# EAGLE design reward_port (EAGLE 6.6.0)
DESIGNER: jakob voigts; DESIGN_NAME: reward port; REVISION: 0.1
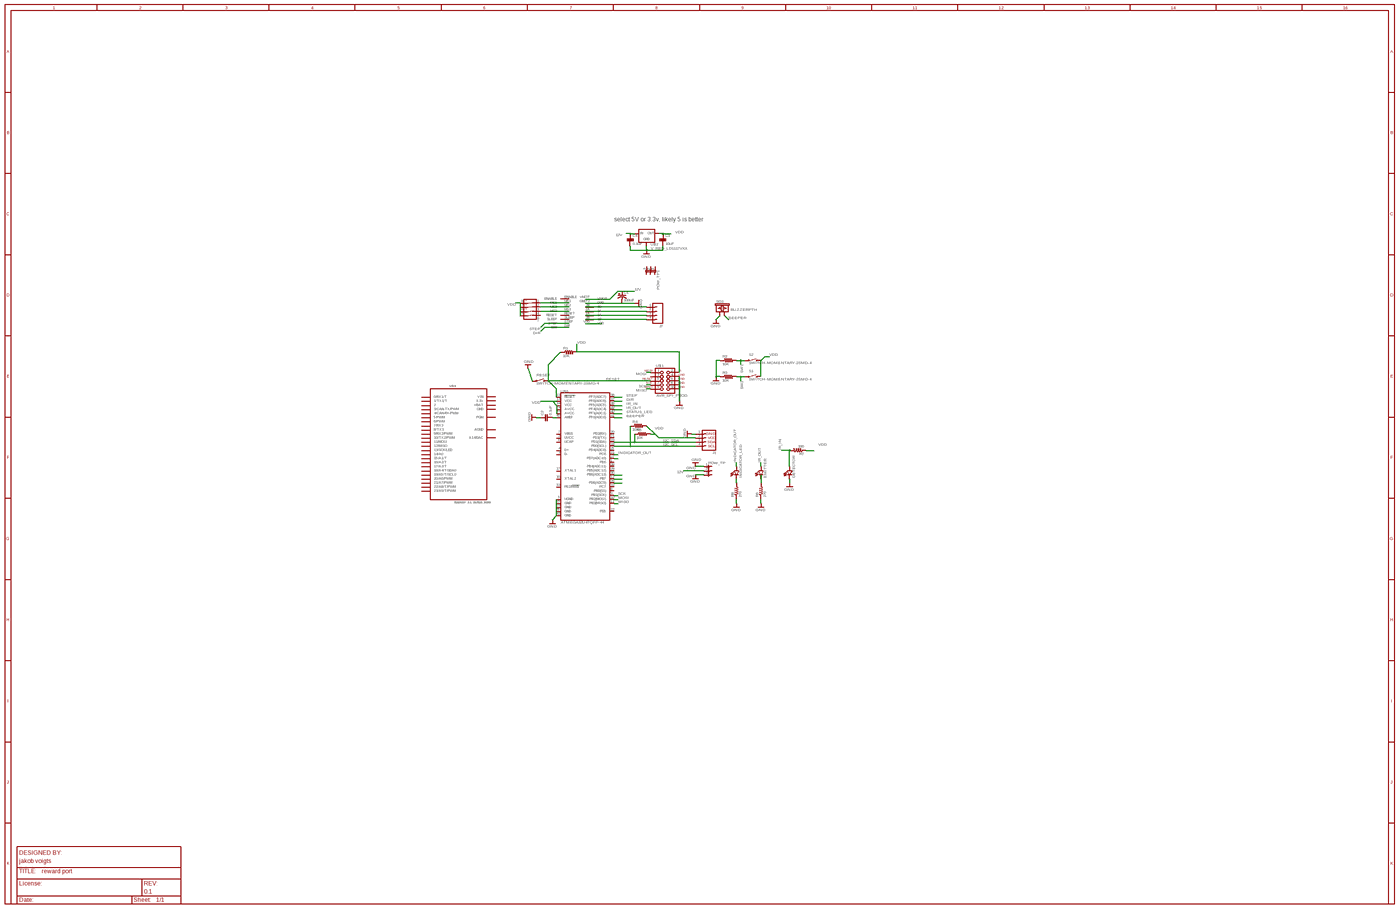
[diagram p0: schematic, sheet 1, overview]
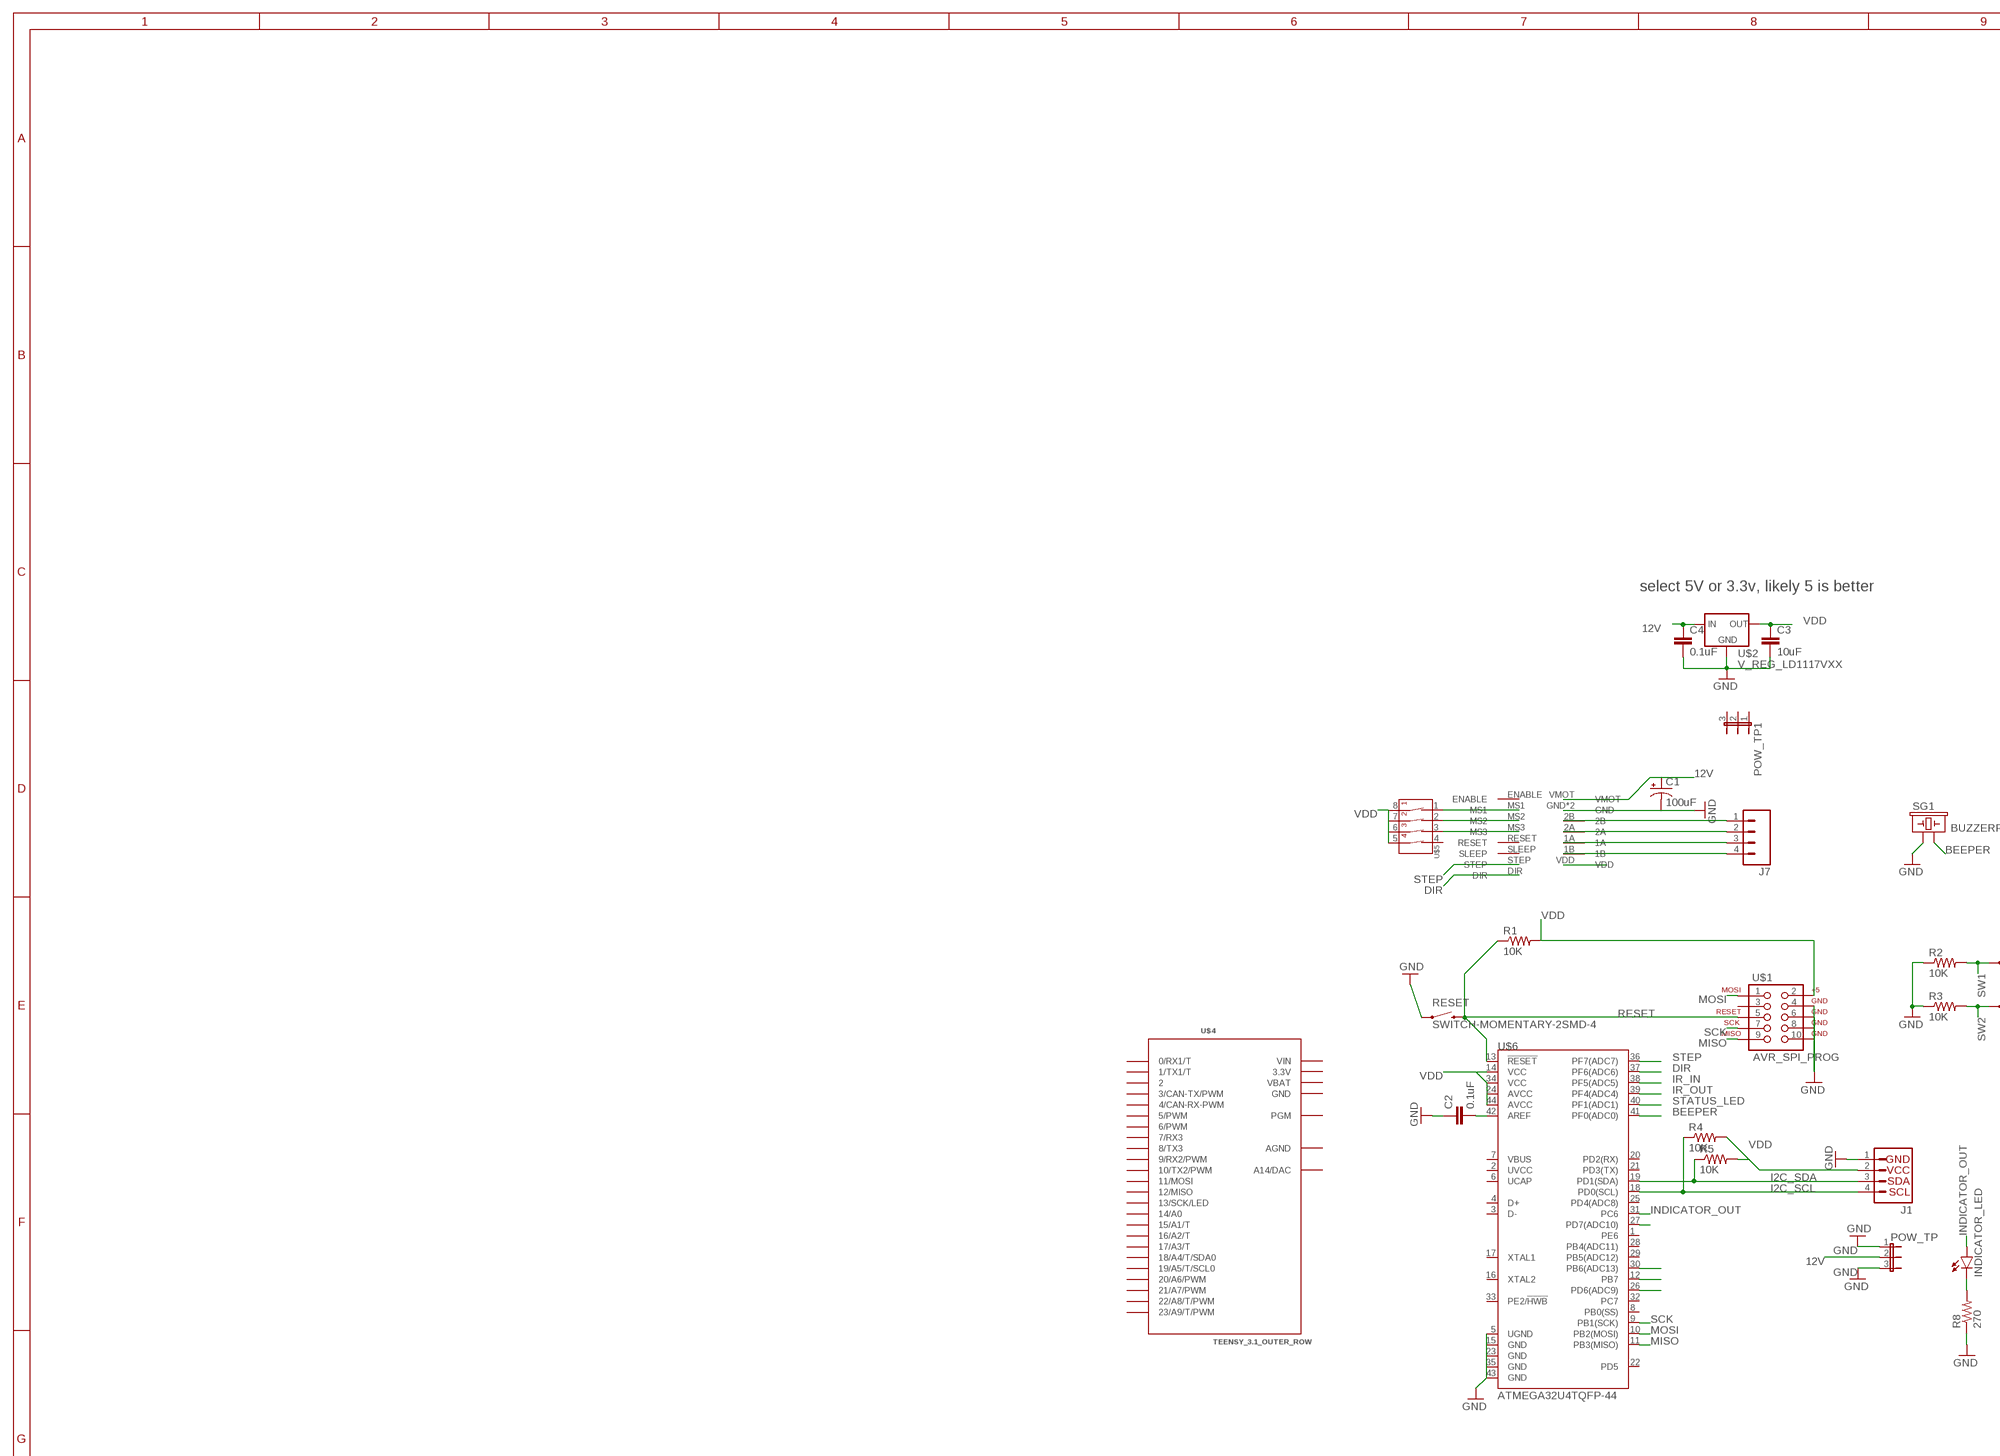
[diagram p1: schematic, sheet 1, part 1 of 4]
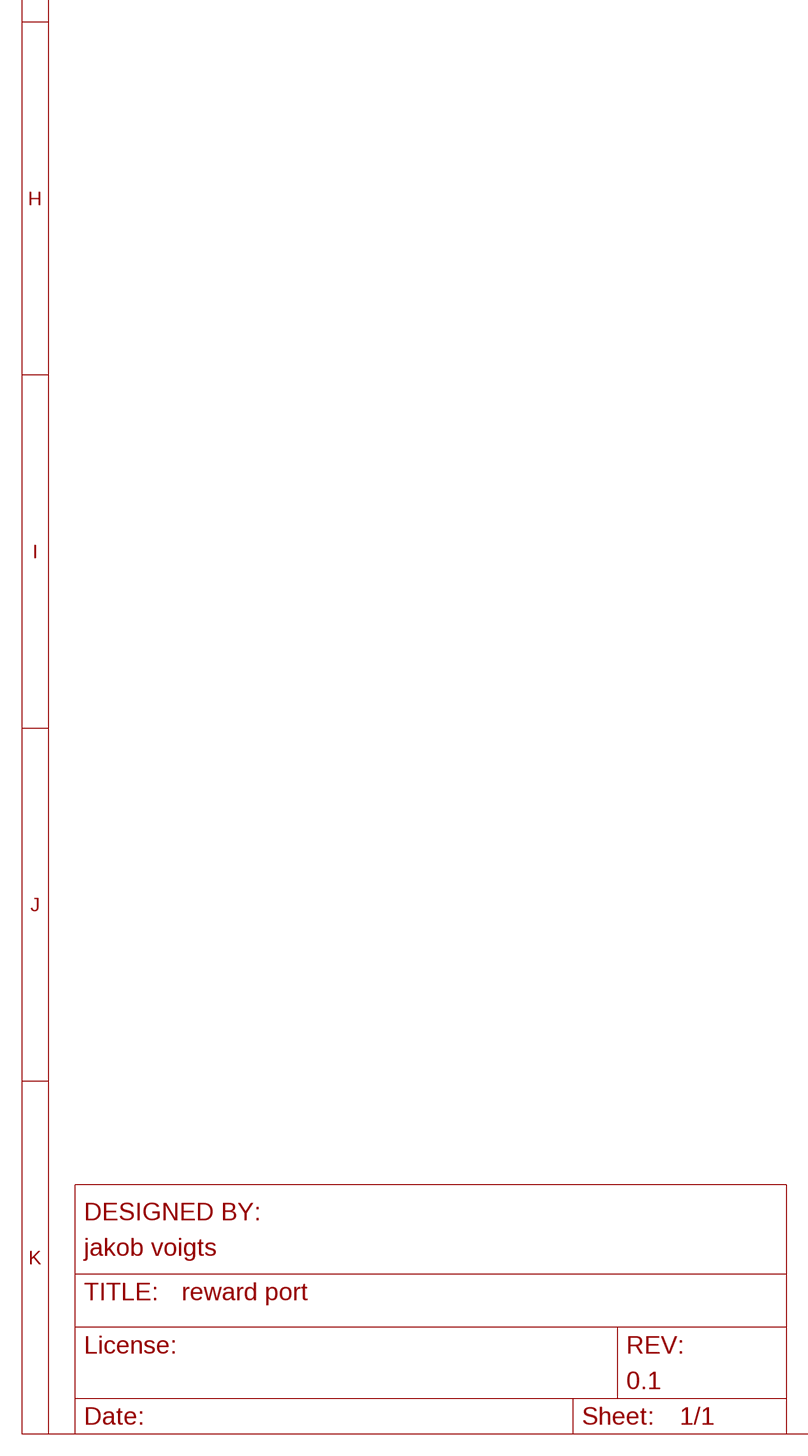
[diagram p2: schematic, sheet 1, part 2 of 4]
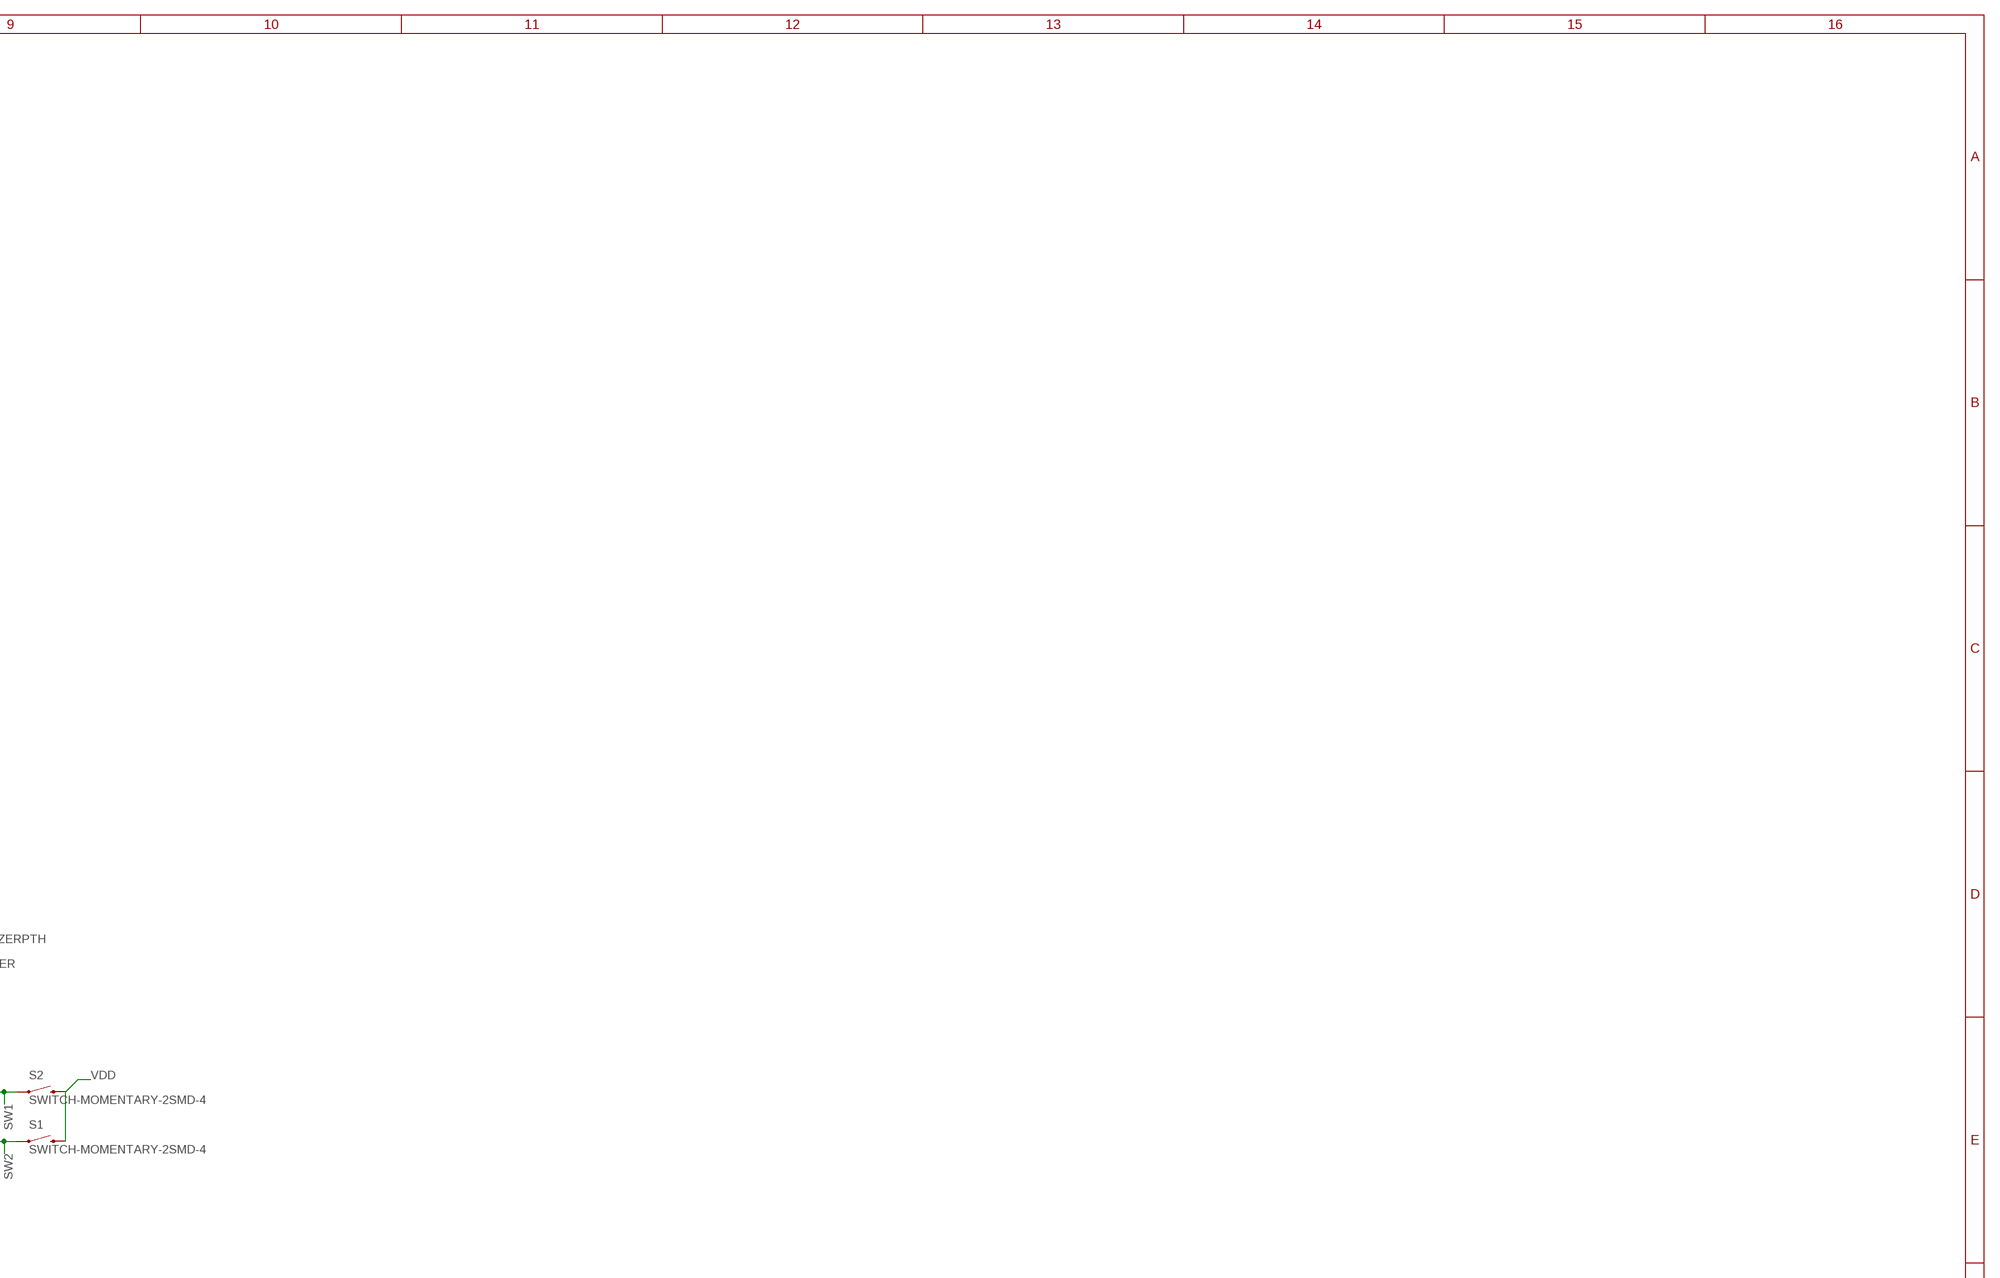
[diagram p3: schematic, sheet 1, part 3 of 4]
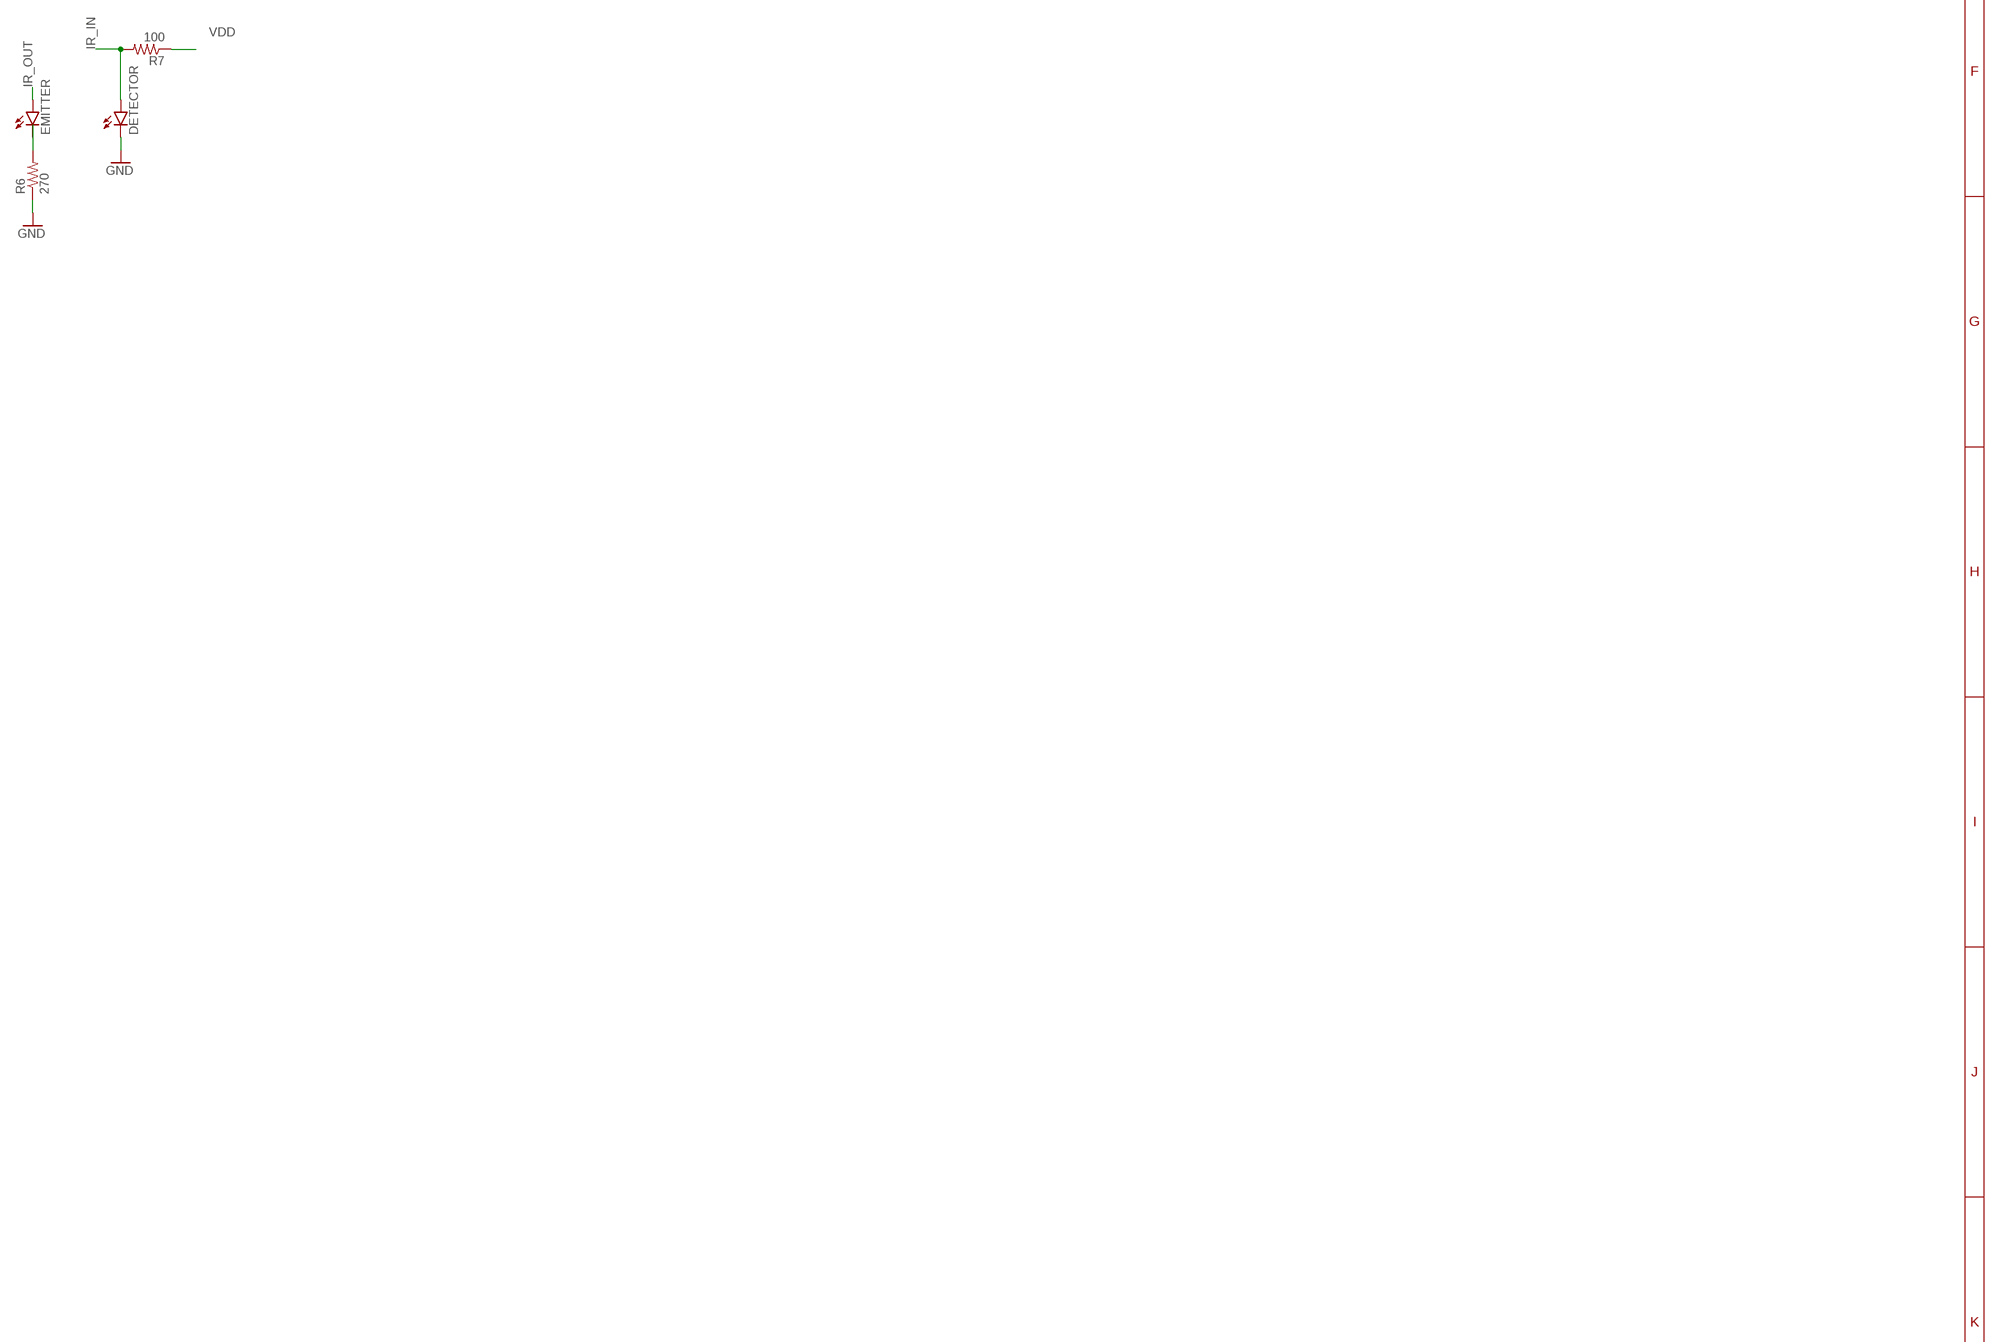
[diagram p4: schematic, sheet 1, part 4 of 4]

## Parts
C1  100uF  100UF-10V-10%(TANT)  [EIA7343]
C2  0.1uF  0.1UF-25V(+80/-20%)(0603)  [0603-CAP]
C3  10uF  10UF-6.3V-20%(0603)  [0603-CAP]
C4  0.1uF  0.1UF-25V-5%(0603)  [0603-CAP]
DETECTOR  LED-3MM-NO_SILK  [LED3MM-NS]
EMITTER  LED-3MM-NO_SILK  [LED3MM-NS]
INDICATOR_LED  LED-3MM-NO_SILK  [LED3MM-NS]
J1  I2C_STANDARD  [1X04]
J7  M04POLAR  [MOLEX-1X4]
POW_TP  JP3E  [JP3]
POW_TP1  JP3E  [JP3]
R1  10K  10KOHM-1/10W-1%(0603)0603  [0603-RES]
R2  10K  10KOHM-1/10W-1%(0603)0603  [0603-RES]
R3  10K  10KOHM-1/10W-1%(0603)0603  [0603-RES]
R4  10K  10KOHM-1/10W-1%(0603)0603  [0603-RES]
R5  10K  10KOHM-1/10W-1%(0603)0603  [0603-RES]
R6  270  10KOHM-1/10W-1%(0603)0603  [0603-RES]
R7  100  10KOHM-1/10W-1%(0603)0603  [0603-RES]
R8  270  10KOHM-1/10W-1%(0603)0603  [0603-RES]
RESET  SWITCH-MOMENTARY-2SMD-4  [TACTILE_SWITCH_TALL]
S1  SWITCH-MOMENTARY-2SMD-4  [TACTILE_SWITCH_TALL]
S2  SWITCH-MOMENTARY-2SMD-4  [TACTILE_SWITCH_TALL]
SG1  BUZZERPTH  [BUZZER-12MM]
U$1  AVR_SPI_PROG  [AVR_ICSP]
U$2  V_REG_LD1117VXX  [78XXL]
U$3  A4988  [A4988]
U$4  TEENSY_3.1_OUTER_ROW  [TEENSY3-OUTER_ROW]
U$5  4-POS-DIP  [4-POS-DIP-SMD]
U$6  ATMEGA32U4TQFP-44  [TQFP44]

## Nets
12V: C1.A(+) C4.1 POW_TP.2 U$2.OUT(IN) U$3.VMOT
BEEPER: SG1.- U$6.41(PF0(ADC0))
DIR: U$3.DIR U$6.37(PF6(ADC6))
GND: C1.C(-) C2.1 C3.2 C4.2 DETECTOR.K(C) J1.1 POW_TP.1 POW_TP.3 R2.1 R3.1 R6.1 R8.1 RESET.A2 SG1.+ U$1.4 U$1.6 U$1.8 U$1.10 U$2.IN(GND) U$3.GND U$3.GND2(GND) U$6.5(UGND) U$6.15(GND) U$6.23(GND) U$6.35(GND) U$6.43(GND)
I2C_SCL: J1.4 R4.1 U$6.18(PD0(SCL))
I2C_SDA: J1.3 R5.1 U$6.19(PD1(SDA))
INDICATOR_OUT: INDICATOR_LED.A U$6.31(PC6)
IR_IN: DETECTOR.A R7.2 U$6.38(PF5(ADC5))
IR_OUT: EMITTER.A U$6.39(PF4(ADC4))
MISO: U$1.9 U$6.11(PB3(MISO))
MOSI: U$1.1 U$6.10(PB2(MOSI))
N$4: U$6.27(PD7(ADC10))
N$5: U$6.30(PB6(ADC13))
N$6: J7.1 U$3.2B
N$7: J7.2 U$3.2A
N$8: J7.3 U$3.1A
N$9: J7.4 U$3.1B
N$10: U$6.12(PB7)
N$11: U$3.MS1 U$5.1(1A)
N$12: U$3.MS2 U$5.2(2A)
N$13: U$3.MS3 U$5.3(3A)
N$14: U$6.26(PD6(ADC9))
N$15: C2.2 U$6.42(AREF)
N$16: INDICATOR_LED.K(C) R8.2
N$21: EMITTER.K(C) R6.2
RESET: R1.1 RESET.B2 U$1.5 U$6.13(!RESET)
SCK: U$1.7 U$6.9(PB1(SCK))
STATUS_LED: U$6.40(PF1(ADC1))
STEP: U$3.STEP U$6.36(PF7(ADC7))
SW1: R2.2 S2.A2
SW2: R3.2 S1.A2
VDD: C3.1 J1.2 R1.2 R4.2 R5.2 R7.1 S1.B2 S2.B2 U$1.2 U$2.GND(OUT) U$3.VDD U$5.5(4B) U$5.6(3B) U$5.7(2B) U$5.8(1B) U$6.14(VCC) U$6.24(AVCC) U$6.34(VCC) U$6.44(AVCC)
Unconnected: POW_TP1.1 POW_TP1.2 POW_TP1.3 U$1.3 U$3.ENABLE U$3.RESET U$3.SLEEP U$4.0(0/RX1/T) U$4.1(1/TX1/T) U$4.2 U$4.3(3/CAN-TX/PWM) U$4.4(4/CAN-RX-PWM) U$4.5(5/PWM) U$4.6(6/PWM) U$4.7(7/RX3) U$4.8(8/TX3) U$4.9(9/RX2/PWM) U$4.10(10/TX2/PWM) U$4.11(11/MOSI) U$4.12(12/MISO) U$4.13(13/SCK/LED) U$4.14/A0 U$4.15/A1(15/A1/T) U$4.16/A2(16/A2/T) U$4.17/A3(17/A3/T) U$4.18/A4(18/A4/T/SDA0) U$4.19/A5(19/A5/T/SCL0) U$4.20/A6(20/A6/PWM) U$4.21/A7(21/A7/PWM) U$4.22/A8(22/A8/T/PWM) U$4.23/A9(23/A9/T/PWM) U$4.PGM U$4.RESET/DAC(A14/DAC) U$5.4(4A) U$6.1(PE6) U$6.2(UVCC) U$6.3(D-) U$6.4(D+) U$6.6(UCAP) U$6.7(VBUS) U$6.8(PB0(SS)) U$6.16(XTAL2) U$6.17(XTAL1) U$6.20(PD2(RX)) U$6.21(PD3(TX)) U$6.22(PD5) U$6.25(PD4(ADC8)) U$6.28(PB4(ADC11)) U$6.29(PB5(ADC12)) U$6.32(PC7) U$6.33(PE2/!HWB)

## Notes on the sheet
- select 5V or 3.3v, likely 5 is better

## Power pins joined to a net without a drawn wire
3.3V: U$4.3.3V U$4.3.3V1(3.3V)
AGND: U$4.AGND
GND: U$4.GND U$4.GND1(GND)
VBAT: U$4.VBAT
VIN: U$4.VIN

## Library data of the parts
C1 = SparkFun-Capacitors:100UF-10V-10%(TANT): CAP-07890; PROD_ID: CAP-07890
C2 = SparkFun-Capacitors:0.1UF-25V(+80/-20%)(0603): CAP-00810 Ceramic Standard decoupling cap; PROD_ID: CAP-00810
C3 = SparkFun-Capacitors:10UF-6.3V-20%(0603): CAP-11015; PROD_ID: CAP-11015
C4 = SparkFun-Capacitors:0.1UF-25V-5%(0603): CAP-08604; PROD_ID: CAP-08604
DETECTOR EMITTER INDICATOR_LED = SparkFun-LED:LED: LEDs Standard schematic elements and footprints for 5mm, 3mm, 1206, and 0603 sized LEDs. 5mm - Spark Fun Electronics SKU : COM-00529 (and others)
J1 = SparkFun-Connectors:I2C_STANDARD: SparkFun has standardized on a pinout for all I2C based sensor breakouts. This pinout allows I2C boards to be plugged directly into the headers on Arduino Uno compatible boards, and to be daisy chained easily.
J7 = SparkFun-Connectors:M04: Header 4 Standard 4-pin 0.1" header. Use with straight break away headers (SKU : PRT-00116), right angle break away headers (PRT-00553), swiss pins (PRT-00743), machine pins (PRT-00117), and female headers (PRT-00115). Molex polarized connector foot print use with SKU : PRT-08231 with associated crimp pins and housings. 1MM SMD Version SKU: PRT-10208
POW_TP POW_TP1 = jonnew:JP3E
R1-R5 = SparkFun-Resistors:10KOHM-1/10W-1%(0603): RES-00824; PROD_ID: RES-00824
R6-R8 = SparkFun-Resistors:10KOHM-1/10W-1%(0603): RES-00824; PROD_ID: RES-00824; VALUE: 10K
RESET S1 S2 = SparkFun-Electromechanical:SWITCH-MOMENTARY-2: Various NO switches- pushbuttons, reed, etc; PROD_ID: SWCH-11966
SG1 = SparkFun-Electromechanical:BUZZER: Buzzer 12mm Spark Fun Electronics SKU : Comp-Buzzer
U$1 = SparkFun-Connectors:AVR_SPI_PROG: AVR 10-pin ICSP Header This is the standard AVR In Circuit Serial Programming header. Minimal, but includes pin one indicator. Works with standard Olimex programmers. Also look for the 6-pin reduced version. Spark Fun Electronics SKU: PRT-00778
U$2 = SparkFun-PowerIC:V_REG_LD1117VXX: LD1117VXX voltage regulator. We carry the 3.3V version (COM-00526) in TO-220 package.
U$3 = behaviour_pcb_parts:A4988
U$4 = Teensy_3_and_LC_Series_Boards_v1.1:TEENSY_3.1_OUTER_ROW: Footprint for Teensy 3.1 or 3.2 board using all pin connections on the outer perimeter
U$5 = SparkFun-Electromechanical:4-POS-DIP: 4 Position DIP Switch CTS series 219; PROD_ID: SWCH-12418
U$6 = SparkFun-DigitalIC:ATMEGA32U4: Atmel 44-pin 8-bit Microcontroller with 32KBytes of ISP Flash and USB Controller

## Board
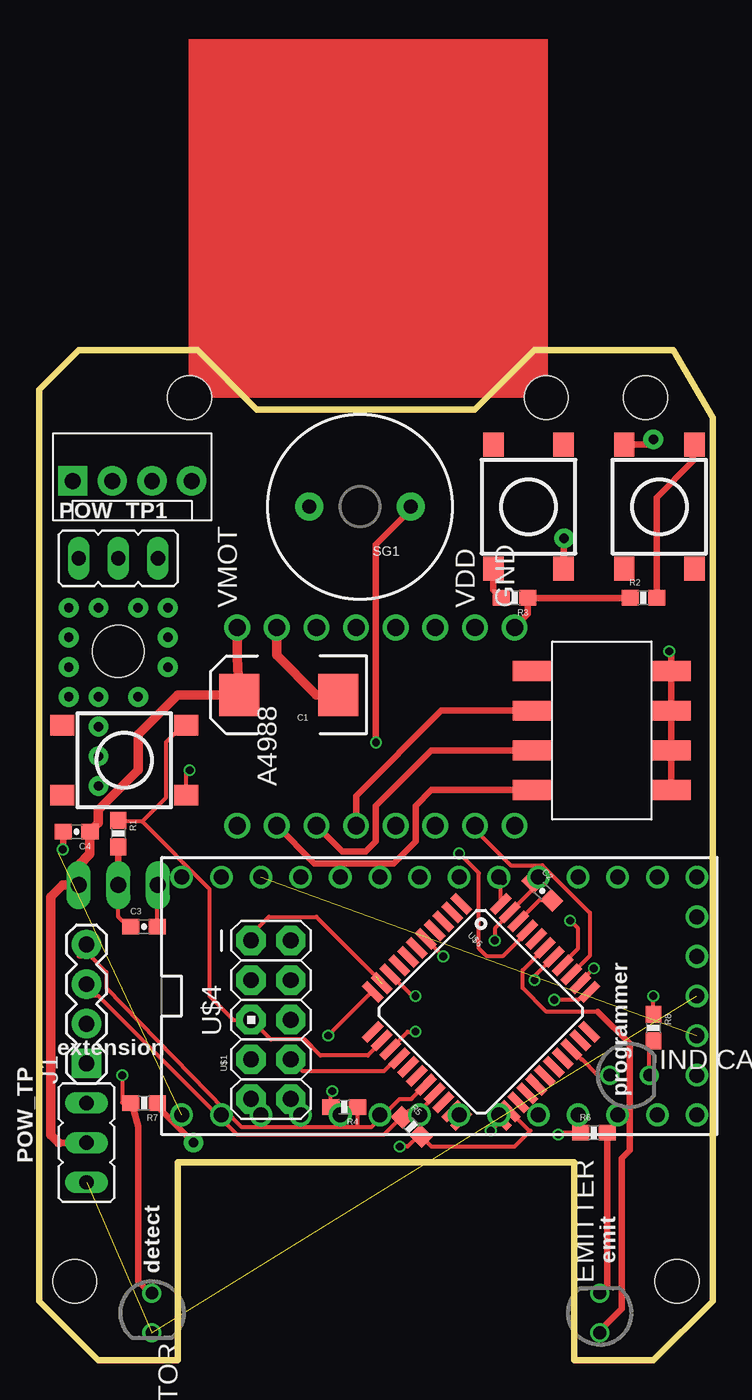
[diagram p5: board, top side]
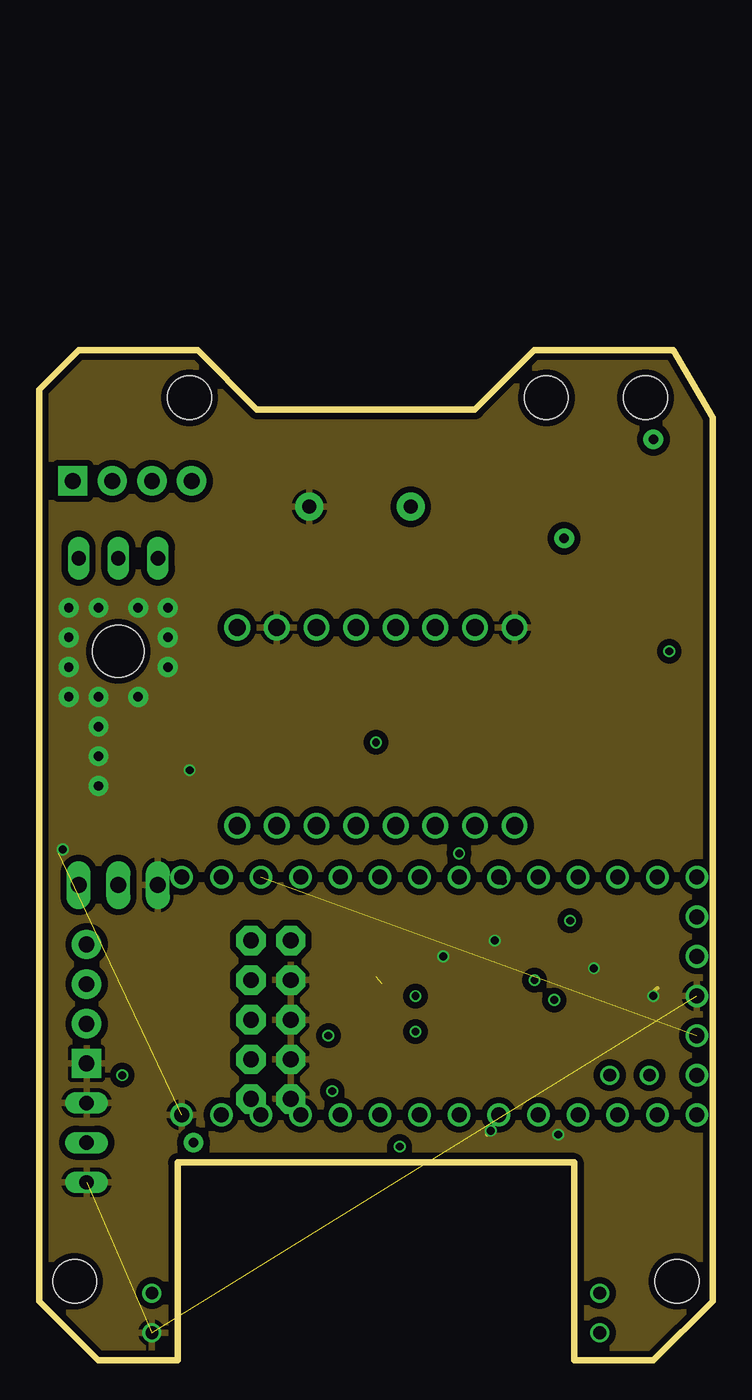
[diagram p6: board, inner layer $GND]
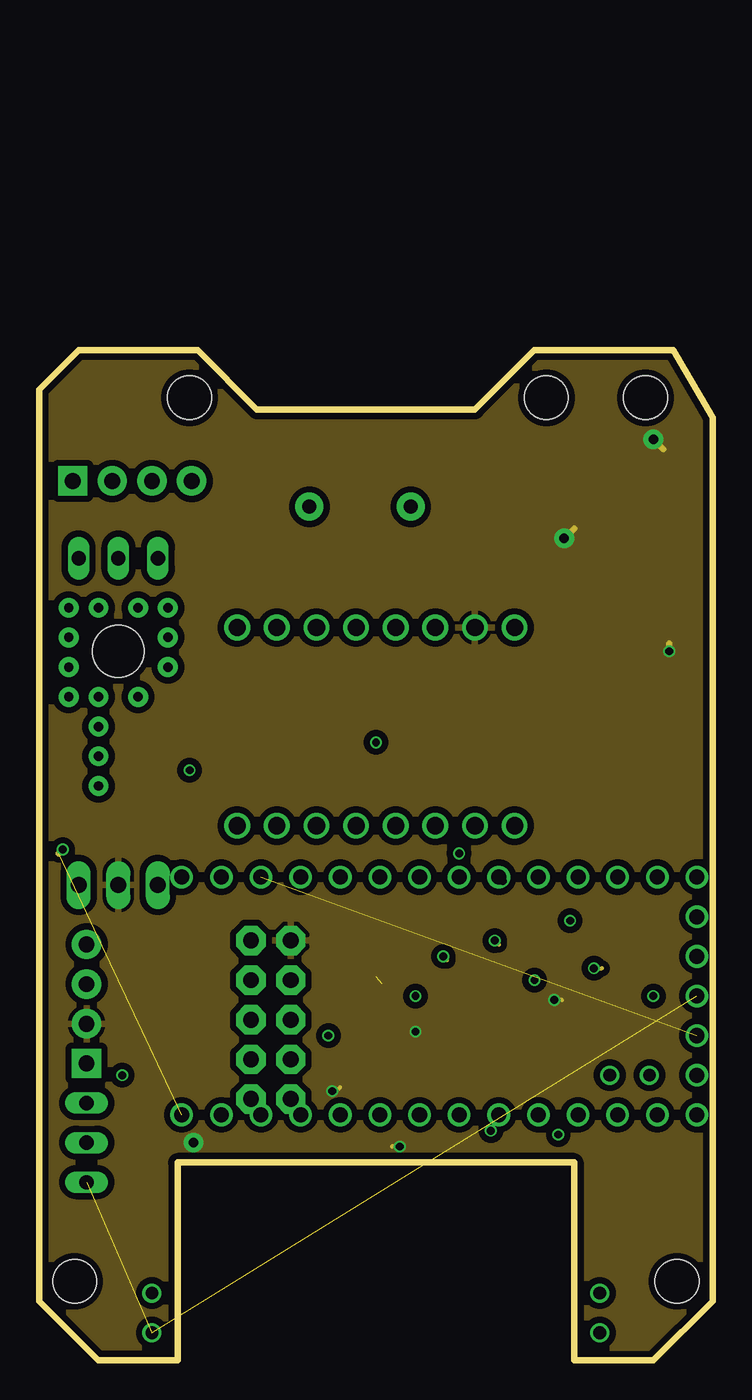
[diagram p7: board, inner layer $VCC]
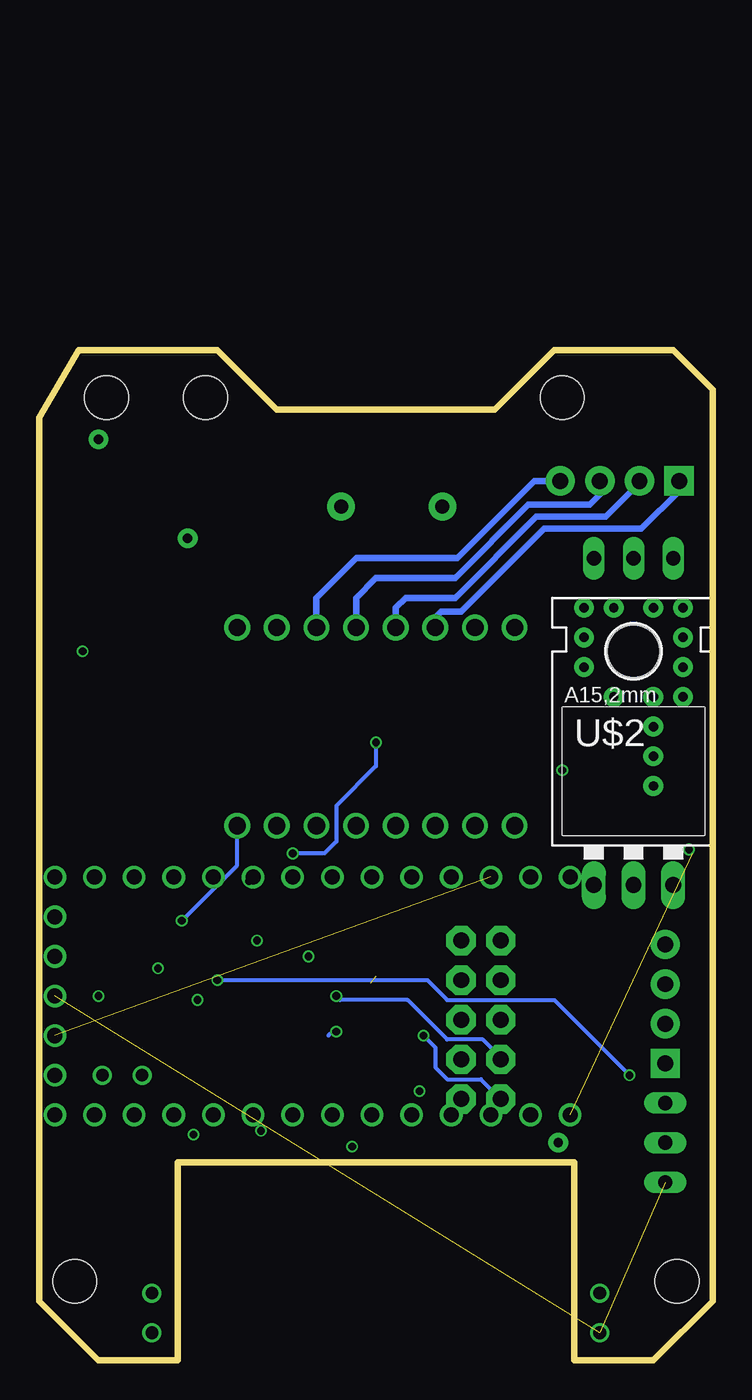
[diagram p8: board, bottom side, seen from below]

Size 43.18 x 64.77 mm. Coordinates in mm from the lower left corner, seen from the top.
Outline: 34.29,12.7 8.89,12.7 8.89,0 3.81,0 0,3.81 0,62.23 2.54,64.77 10.16,64.77 13.97,60.96 27.94,60.96 31.75,64.77 40.64,64.77 43.18,60.45 43.18,3.81 39.37,0 34.29,0 34.29,12.7
Copper layers (1*2*15*16): Top 0.035mm / dielectric 0.2mm / $GND 0.0175mm / dielectric 0.3mm / $VCC 0.0175mm / dielectric 0.2mm / Bottom 0.035mm
Design rules "seeed-studio-4-layer": minimum track width 8mil, minimum drill 12mil, track to track 8mil, track to pad 8mil, pad to pad 8mil, via to via 8mil, smd to smd 0mil, copper to edge 10mil, drill to drill 8mil, minimum pad ring 6mil, minimum via ring 4mil, stop-mask expansion 4mil, vias tented up to drill 100mil, thermal gap 10mil
Holes 2.8 mm at 9.65,61.72 32.51,61.72 40.89,5.08 2.29,5.08 38.86,61.72

### Footprints (pad centres in the part's own frame; a part is rotated, then mirrored left to right if it is on the bottom)
EIA7343 = smd 2.55 x 2.7: A 3.17,0; C -3.17,0
0603-CAP = smd 1.1 x 1: 1 -0.85,0; 2 0.85,0
LED3MM-NS = drill 0.813: A -1.27,0; K 1.27,0
1X04 = drill 1.016 pad 1.88 square: 1 0,0 | drill 1.016 pad 1.88: 2 2.54,0; 3 5.08,0; 4 7.62,0
MOLEX-1X4 = drill 1.016 pad 1.88 square: 1 0,0 | drill 1.016 pad 1.88: 2 2.54,0; 3 5.08,0; 4 7.62,0
JP3 = drill 0.914 long: 1 0,0; 2 2.54,0; 3 5.08,0
0603-RES = smd 1.1 x 1: 1 -0.85,0; 2 0.85,0
TACTILE_SWITCH_TALL = smd 1.55 x 1.3: A1 -3.975,-2.25; A2 3.975,-2.25; B1 -3.975,2.25; B2 3.975,2.25
BUZZER-12MM = drill 0.9 pad 1.778: + 3.25,0; - -3.25,0
AVR_ICSP = drill 1.016 pad 1.88 octagon: 1 -1.27,5.08; 2 1.27,5.08; 3 -1.27,2.54; 4 1.27,2.54; 5 -1.27,0; 6 1.27,0; 7 -1.27,-2.54; 8 1.27,-2.54; 9 -1.27,-5.08; 10 1.27,-5.08
78XXL = drill 1.016 long: GND 0,-3.81; IN -2.54,-3.81; OUT 2.54,-3.81 | hole 3.302: 0,11.176
A4988 = drill 1.1: 1A 12.7,-2.54; 1B 12.7,-5.08; 2A 12.7,0; 2B 12.7,2.54; DIR 0,-10.16; ENABLE 0,7.62; GND 12.7,-10.16; GND2 12.7,5.08; MS1 0,5.08; MS2 0,2.54; MS3 0,0; RESET 0,-2.54; SLEEP 0,-5.08; STEP 0,-7.62; VDD 12.7,-7.62; VMOT 12.7,7.62
TEENSY3-OUTER_ROW = drill 0.965: 0 -7.62,13.97; 1 -7.62,11.43; 2 -7.62,8.89; 3 -7.62,6.35; 3.3V 7.62,11.43; 3.3V1 -2.54,-16.51; 4 -7.62,3.81; 5 -7.62,1.27; 6 -7.62,-1.27; 7 -7.62,-3.81; 8 -7.62,-6.35; 9 -7.62,-8.89; 10 -7.62,-11.43; 11 -7.62,-13.97; 12 -7.62,-16.51; 13 7.62,-16.51; 14/A0 7.62,-13.97; 15/A1 7.62,-11.43; 16/A2 7.62,-8.89; 17/A3 7.62,-6.35; 18/A4 7.62,-3.81; 19/A5 7.62,-1.27; 20/A6 7.62,1.27; 21/A7 7.62,3.81; 22/A8 7.62,6.35; 23/A9 7.62,8.89; AGND 7.62,13.97; GND -7.62,16.51; GND1 0,-16.51; PGM 2.54,-16.51; RESET/DAC 5.08,-16.51; VBAT -5.08,-16.51; VIN 7.62,16.51
4-POS-DIP-SMD = smd 1.27 x 2.54: 1 -3.81,4.445; 2 -1.27,4.445; 3 1.27,4.445; 4 3.81,4.445; 5 3.81,-4.445; 6 1.27,-4.445; 7 -1.27,-4.445; 8 -3.81,-4.445
TQFP44 = smd 1.5 x 0.5: 1 -5.8,4; 2 -5.8,3.2; 3 -5.8,2.4; 4 -5.8,1.6; 5 -5.8,0.8; 6 -5.8,0; 7 -5.8,-0.8; 8 -5.8,-1.6; 9 -5.8,-2.4; 10 -5.8,-3.2; 11 -5.8,-4; 23 5.8,-4; 24 5.8,-3.2; 25 5.8,-2.4; 26 5.8,-1.6; 27 5.8,-0.8; 28 5.8,0; 29 5.8,0.8; 30 5.8,1.6; 31 5.8,2.4; 32 5.8,3.2; 33 5.8,4 | smd 0.5 x 1.5: 12 -4,-5.8; 13 -3.2,-5.8; 14 -2.4,-5.8; 15 -1.6,-5.8; 16 -0.8,-5.8; 17 0,-5.8; 18 0.8,-5.8; 19 1.6,-5.8; 20 2.4,-5.8; 21 3.2,-5.8; 22 4,-5.8; 34 4,5.8; 35 3.2,5.8; 36 2.4,5.8; 37 1.6,5.8; 38 0.8,5.8; 39 0,5.8; 40 -0.8,5.8; 41 -1.6,5.8; 42 -2.4,5.8; 43 -3.2,5.8; 44 -4,5.8

### Placement (x,y rotation side)
C1  16,42.67 180 top
C2  32.26,30.1 315 top
C3  6.73,27.81 0 top
C4  2.41,33.91 180 top
DETECTOR  7.24,3.05 270 top
EMITTER  35.94,3.05 90 top
INDICATOR_LED  37.85,18.29 0 top
J1  3.05,19.05 90 top
J7  2.16,56.39 0 top
POW_TP  3.05,16.51 270 top
POW_TP1  2.54,51.44 0 top
R1  5.08,33.78 270 top
R2  38.73,48.89 0 top
R3  30.48,48.89 180 top
R4  19.56,16.26 180 top
R5  23.88,14.99 315 top
R6  35.56,14.6 0 top
R7  6.73,16.51 180 top
R8  39.37,21.34 270 top
RESET  5.46,38.48 0 top
S1  31.37,54.74 270 top
S2  39.75,54.74 90 top
SG1  20.57,54.74 180 top
U$1  14.86,21.84 0 top
U$2  5.08,34.29 0 bottom
U$3  20.32,34.29 90 top
U$4  25.65,23.37 90 top
U$5  36.07,40.39 90 top
U$6  28.32,22.35 315 top

### Tracks (layer width: path | path; a pad name or v marks a point on that pad's centre or on a via)
3.3V  (1 unrouted)
12V
  Top 0.254: 2.54,31.75 2.54,32
  Top 0.406: 1.27,13.97 POW_TP.2
  Top 0.61: U$3.VMOT 12.7,45.08 C1.A 8.89,42.67 6.35,40.13 6.35,37.85 3.81,35.31 3.81,34.46 C4.1 3.26,32.47 2.54,31.75 U$2.OUT 1.52,30.48 0.76,29.72 0.76,14.48 1.27,13.97
BEEPER  (via drill 0.5)
  Top 0.254: U$6.41 31.29,27.48 29.72,25.91 28.7,25.91 28.19,26.42 28.19,31.24 v26.92,32.51
  Top 0.406: SG1.- 23.82,54.56 21.59,52.32 v21.59,39.62
  Bottom 0.254: v21.59,39.62 21.59,38.1 24.13,35.56 24.13,33.27 24.89,32.51 v26.92,32.51
DIR  (via drill 0.5)
  Top 0.254: U$6.37 33.55,25.43 34.54,26.42 34.54,27.69 v34.04,28.19
  Bottom 0.254: v34.04,28.19 30.48,31.75 U$3.DIR
GND  (via drill 0.5, 0.6 pad 1.27)  (3 unrouted)
  Top 0.254: R6.1 33.4,14.6 v33.27,14.48 | U$6.23 29.59,15.37 v28.96,14.73 | v29.21,26.92 29.21,27.69 30.16,28.63 U$6.43 31.66,30.21 C2.1 | U$6.5 v25.91,25.91 | U$6.35 34.69,24.27 v35.56,25.15 | RESET.A2 9.44,37.63 v9.65,37.85 | C3.2 7.58,30.44 U$2.IN | U$6.15 22.94,19.38 22.1,18.54 16.89,18.54 U$1.8 | R8.1 v39.37,23.37
  Top 0.406: R2.1 R3.1 31.33,47.84 U$3.GND | C4.2 1.56,32.8 v1.52,32.77
  Top 0.61: U$3.GND2 15.24,45.21 17.78,42.67 C1.C
  $GND 0.254: v28.96,14.73 28.7,14.48 | v39.37,23.37 39.37,23.62 39.62,23.88
  $VCC 0.254: v33.27,14.48 33.02,14.48 | v29.21,26.92 29.46,26.67 | v25.91,25.91 26.16,25.65 | v35.56,25.15 36.07,25.15 | v9.65,37.85 9.91,37.85
  $VCC 0.406: v1.52,32.77 1.27,32.51
  other vias: 1.91,44.45 1.91,42.55 3.81,42.55 6.35,42.55 3.81,40.64 3.81,38.73 3.81,36.83 1.91,46.36 3.81,48.26 1.91,48.26 6.35,48.26 8.25,46.36 8.25,44.45 8.25,48.26
  pour $GND (isolate 0.406): -1.27,67.31 -1.27,-1.91 48.64,-3.94 47.62,67.31
I2C_SCL
  Top 0.254: J1.4 2.54,25.91 3.3,25.91 4.32,24.89 4.32,23.88 12.95,14.99 20.32,14.99 | 20.32,14.99 21.34,14.99 23.11,16.76 23.86,16.76 U$6.18 | R4.1 20.41,15.07 20.32,14.99
I2C_SDA
  Top 0.254: U$6.19 25.35,16.97 24.38,16 23.69,16 R5.1 23.21,15.59 22.1,14.48 12.7,14.48 3.81,23.37 3.3,23.37 J1.3
INDICATOR_OUT
  Top 0.254: INDICATOR_LED.A 35.81,18.29 34.8,19.3 34.76,19.3 U$6.31
IR_IN  (via drill 0.5)
  Top 0.254: U$6.38 32.99,25.88 31.75,24.64 v31.75,24.38 | v5.33,18.29 5.33,16.55 R7.2
  Top 0.406: DETECTOR.A 7.11,4.32 6.35,5.08 6.35,15.02 6.06,16.04 5.84,16.26 R7.2
  Bottom 0.254: v31.75,24.38 18.29,24.38 17.02,23.11 10.16,23.11 v5.33,18.29
IR_OUT
  Top 0.254: 35.81,22.35 32.51,22.35 30.99,23.88 30.99,25.02 U$6.39
  Top 0.406: EMITTER.A 35.94,1.9 37.34,3.3 37.34,12.95 37.85,13.46 37.85,20.32 35.81,22.35
MISO  (via drill 0.5)
  Top 0.254: U$6.11 21.34,23.62 v18.54,20.83
  Bottom 0.254: v18.54,20.83 17.78,20.07 17.78,18.8 17.02,18.03 14.86,18.03 U$1.9
MOSI  (1 unrouted)
  Top 0.254: U$1.1 13.59,27.3 14.73,28.45 17.78,28.45 21.59,24.64
N$6
  Bottom 0.406: U$3.2B 17.78,47.62 17.4,48.01 16.13,48.01 10.79,53.34 4.57,53.34 2.16,55.75 J7.1
N$7
  Bottom 0.406: U$3.2A 20.32,48.26 19.68,48.89 16.51,48.89 11.3,54.1 6.86,54.1 4.7,56.26 J7.2
N$8
  Bottom 0.406: U$3.1A 22.86,48.89 21.59,50.17 16.51,50.17 11.81,54.86 7.87,54.86 7.24,55.5 J7.3
N$9
  Bottom 0.406: U$3.1B 25.4,48.89 22.86,51.44 16.38,51.44 11.43,56.39 J7.4
N$11
  Top 0.406: U$5.1 25.15,36.58 24.13,35.56 24.13,33.27 22.73,31.88 17.65,31.88 U$3.MS1
N$12
  Top 0.406: U$5.2 25.15,39.12 21.59,35.56 21.59,33.27 20.95,32.64 19.43,32.64 U$3.MS2
N$13
  Top 0.406: U$5.3 25.78,41.66 20.32,36.2 U$3.MS3
N$15
  Top 0.254: C2.2 32.07,29.5 U$6.42
N$16
  Top 0.254: INDICATOR_LED.K 39.12,20.23 R8.2
N$21
  Top 0.406: R6.2 36.41,4.79 EMITTER.K
RESET
  Top 0.254: RESET.B2 9.44,40.93 8.13,39.62 8.13,36.07 6.6,34.54 | 6.6,34.54 5.17,34.54 R1.1 | 6.6,34.54 10.92,30.23 10.92,23.37 12.45,21.84 U$1.5 14.86,20.57 17.02,20.57 18.03,19.56 21.08,19.56 21.96,20.43 U$6.13
  Top 0.406: 4.91,34.8 R1.1
SCK  (via drill 0.5)
  Top 0.254: 22.52,24.72 U$6.9 23.91,23.37 v24.13,23.37
  Bottom 0.254: U$1.7 13.59,19.43 14.73,20.57 17.02,20.57 19.56,23.11 23.88,23.11 v24.13,23.37
STEP
  Top 0.254: U$3.STEP 27.94,34.04 30.23,31.75 32.26,31.75 35.31,28.7 35.31,25.94 U$6.36
SW1
  Top 0.406: R2.2 39.59,55.33 41.91,57.66 41.91,58.62 S2.A2
SW2
  Top 0.406: S1.A2 29.12,49.41 R3.2
VDD  (via drill 0.5, 0.6 pad 1.27)
  Top 0.254: U$6.34 35.25,23.57 34.54,23.11 v33.02,23.11 | R5.2 | R5.2 25.15,13.72 30.48,13.72 31.5,14.73 31.42,14.73 U$6.24 | R4.2 18.71,17.18 v18.8,17.27 | R5.2 24.29,14.38 23.62,13.72 v23.11,13.72 | U$6.14 22.52,19.98 23.62,21.08 v24.13,21.08 | U$6.44 29.59,30.61 v29.72,30.73 | C3.1 5.71,27.81 5.08,28.45 U$2.GND
  Top 0.406: U$5.8 U$5.7 40.64,39.24 40.64,39.37 40.51,39.5 U$5.6 U$5.5 40.51,45.34 v40.39,45.47 | S2.B2 39.03,58.71 v39.37,59.05 | S1.B2 33.62,52.67 v33.66,52.7 | R7.1 7.58,16.29 v9.91,13.97 | U$2.GND R1.2
  $VCC 0.254: 33.53,23.11 33.27,23.11 | v18.8,17.27 19.05,17.27 19.3,17.53 | v23.11,13.72 22.61,13.72
  $VCC 0.406: v39.37,59.05 40,58.42 | v33.66,52.7 34.29,53.34 | v9.91,13.97 9.53,13.97 | v40.39,45.47 40.39,45.97
  Bottom 0.254: v24.13,21.08 24.38,21.08 24.64,20.83 | v29.72,30.73 29.72,30.99
  pour $VCC (isolate 0.406): 46.99,66.04 1.91,66.04 -1.27,62.86 -1.27,-1.27 47.5,-3.05
(copper drawn outside any net)
  shapes: Top area x1

### Text on the board
tPlace: +3v3 | programmer | extension | emit | detect